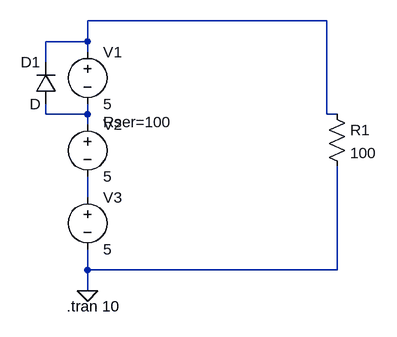
[diagram p0: schematic Bypass Diode for Source Resistance.asc]
Bypass Diode for Source Resistance.asc, the LTspice schematic file:
Version 4
SHEET 1 880 680
WIRE 416 16 48 16
WIRE 48 48 48 16
WIRE 48 48 -16 48
WIRE 48 64 48 48
WIRE -16 80 -16 48
WIRE -16 160 -16 144
WIRE 48 160 48 144
WIRE 48 160 -16 160
WIRE 416 160 416 16
WIRE 432 160 416 160
WIRE 48 176 48 160
WIRE 48 288 48 256
WIRE 48 400 48 368
WIRE 432 400 432 240
WIRE 432 400 48 400
WIRE 48 432 48 400
FLAG 48 432 0
SYMBOL voltage 48 48 R0
WINDOW 123 0 0 Left 0
WINDOW 39 24 124 Left 2
SYMATTR SpiceLine Rser=100
SYMATTR InstName V1
SYMATTR Value 5
SYMBOL voltage 48 160 R0
WINDOW 123 0 0 Left 0
WINDOW 39 0 0 Left 0
SYMATTR InstName V2
SYMATTR Value 5
SYMBOL voltage 48 272 R0
WINDOW 123 0 0 Left 0
WINDOW 39 0 0 Left 0
SYMATTR InstName V3
SYMATTR Value 5
SYMBOL res 416 144 R0
SYMATTR InstName R1
SYMATTR Value 100
SYMBOL diode 0 144 R180
WINDOW 0 24 64 Left 2
WINDOW 3 24 0 Left 2
SYMATTR InstName D1
TEXT 16 456 Left 2 !.tran 10

The netlist it stands for:
* Bypass Diode for Source Resistance.asc
V1 N001 N002 5 Rser=100
V2 N002 N003 5
V3 N003 0 5
R1 N001 0 100
D1 N002 N001 D
.model D D
.lib standard.dio
.tran 10
.backanno
.end